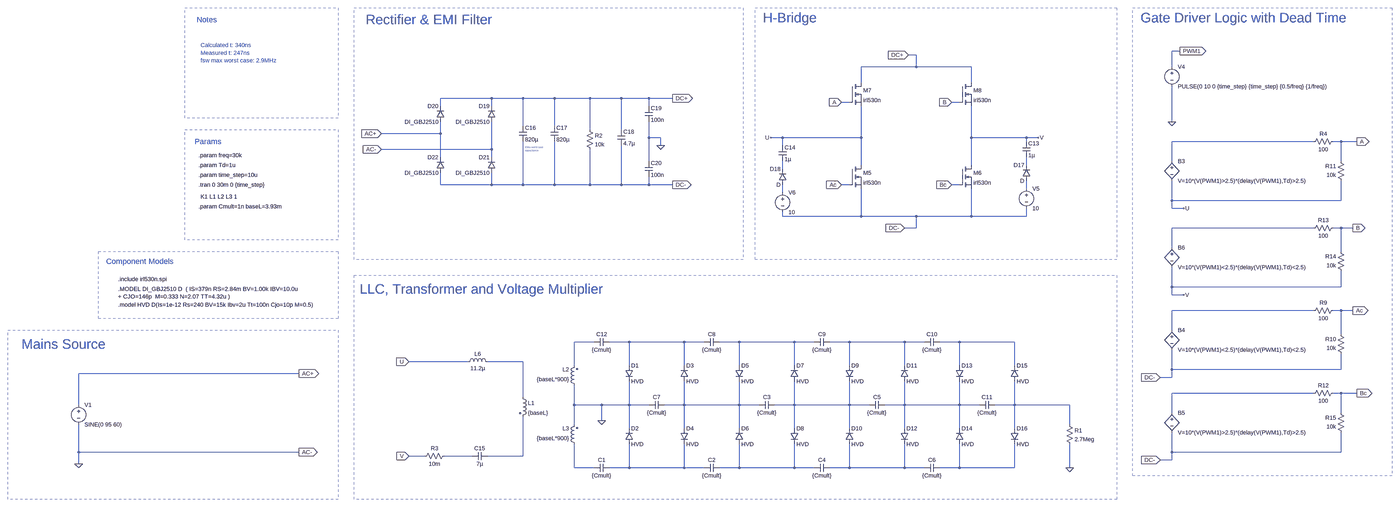
[diagram p0: schematic PowerConverter_AllStages.asc, whole sheet]
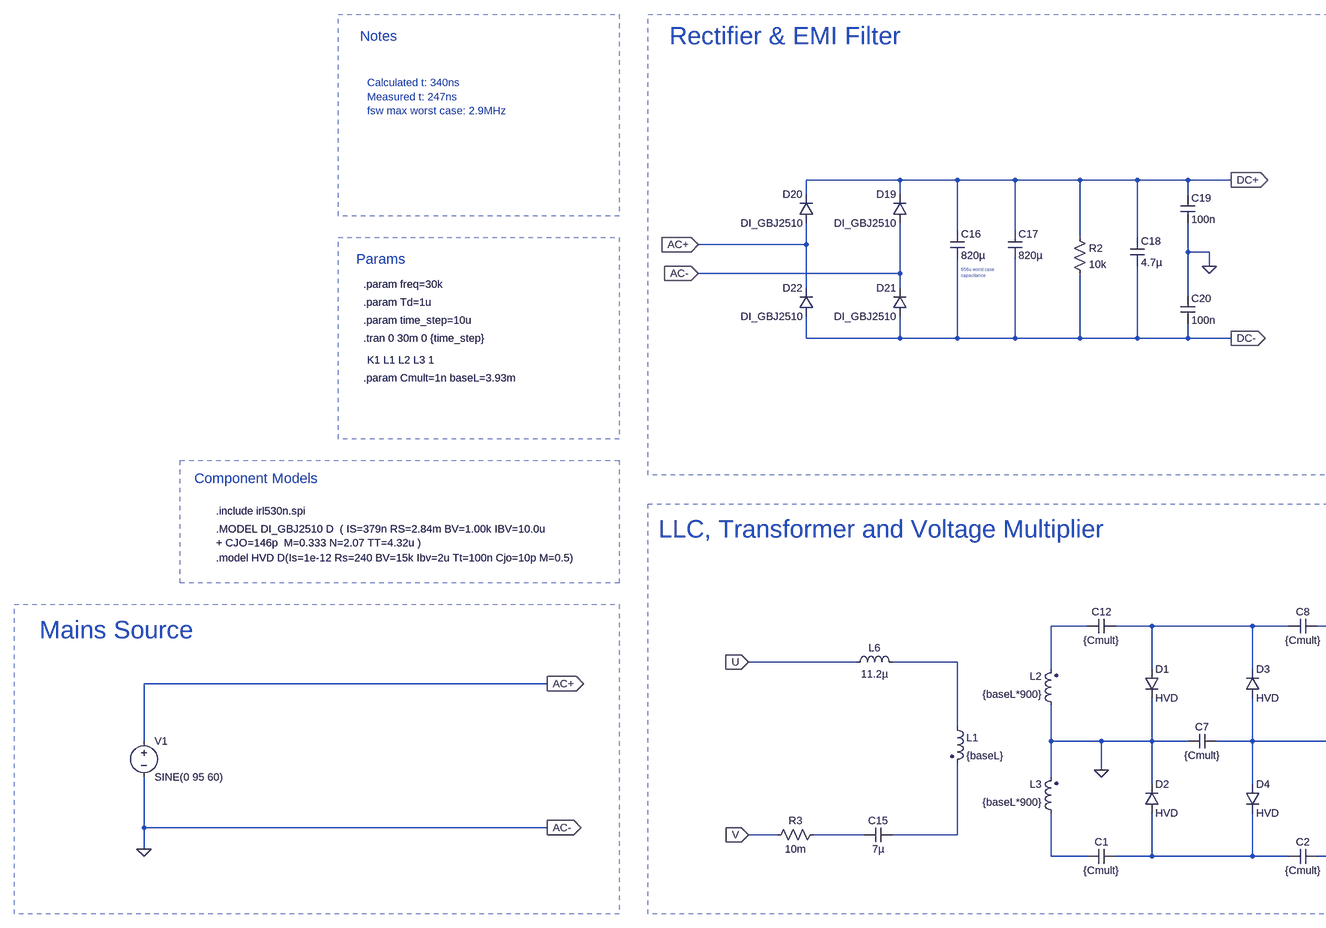
[diagram p1: schematic PowerConverter_AllStages.asc, part, row 1 of 1, column 1 of 2]
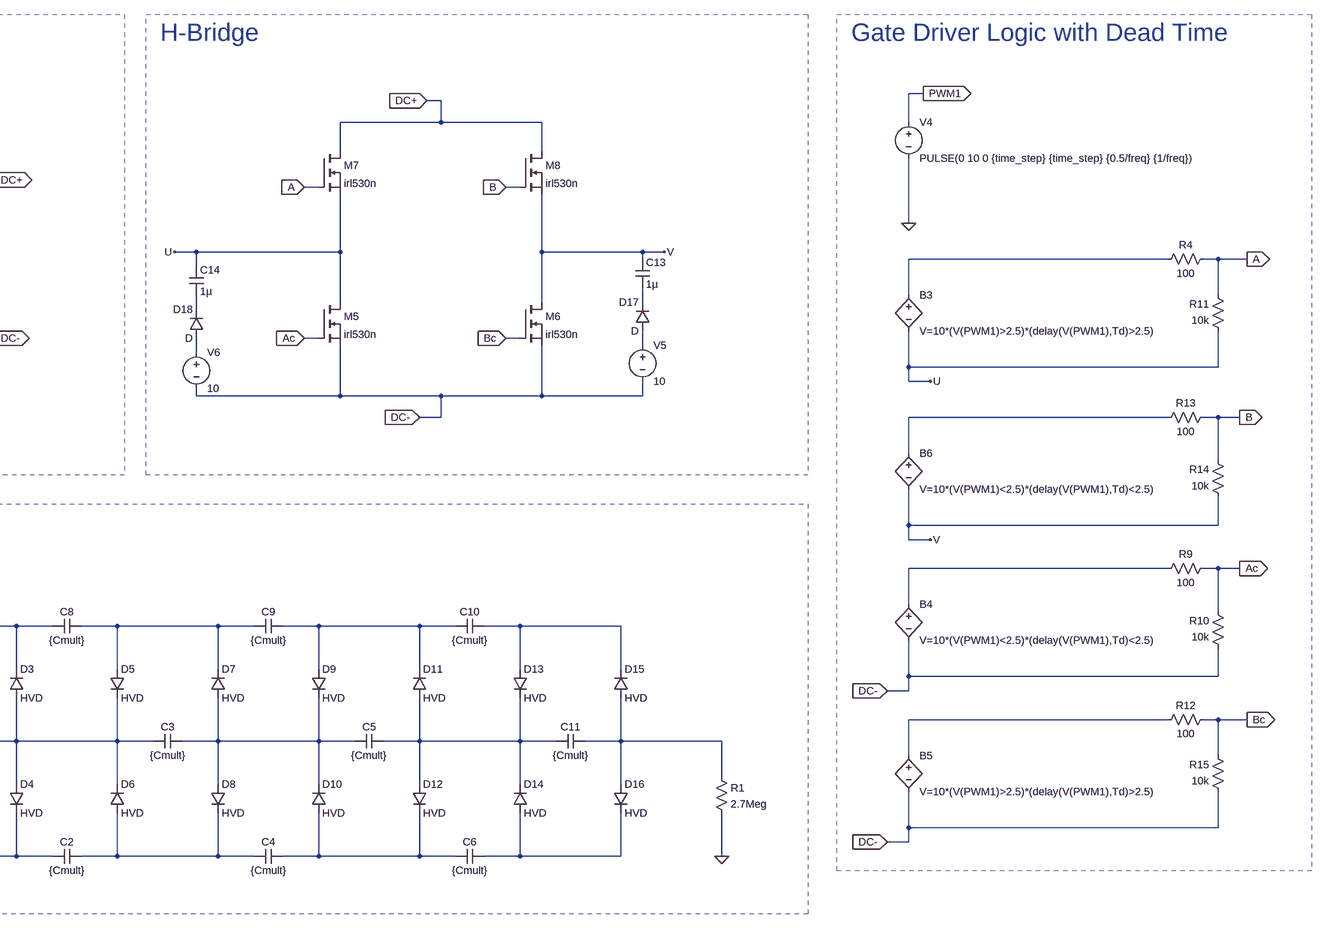
[diagram p2: schematic PowerConverter_AllStages.asc, part, row 1 of 1, column 2 of 2]
PowerConverter_AllStages.asc, the LTspice schematic file:
Version 4.1
SHEET 1 5252 740
WIRE 48 -1456 16 -1456
WIRE -1024 -1440 -1056 -1440
WIRE -1024 -1392 -1024 -1440
WIRE -1024 -1392 -1248 -1392
WIRE -800 -1392 -1024 -1392
WIRE 16 -1392 16 -1456
WIRE -1248 -1328 -1248 -1392
WIRE -800 -1328 -800 -1392
WIRE -2752 -1264 -2960 -1264
WIRE -2624 -1264 -2752 -1264
WIRE -2496 -1264 -2624 -1264
WIRE -2352 -1264 -2496 -1264
WIRE -2224 -1264 -2352 -1264
WIRE -2112 -1264 -2224 -1264
WIRE -2016 -1264 -2112 -1264
WIRE -1296 -1248 -1328 -1248
WIRE -848 -1248 -880 -1248
WIRE -2960 -1232 -2960 -1264
WIRE -2752 -1232 -2752 -1264
WIRE -2112 -1232 -2112 -1264
WIRE 16 -1168 16 -1312
WIRE -2624 -1152 -2624 -1264
WIRE -2496 -1152 -2496 -1264
WIRE -2352 -1136 -2352 -1264
WIRE -2224 -1136 -2224 -1264
WIRE -2960 -1120 -2960 -1168
WIRE -2960 -1120 -3200 -1120
WIRE -2112 -1104 -2112 -1168
WIRE -2064 -1104 -2112 -1104
WIRE -1568 -1104 -1616 -1104
WIRE -1248 -1104 -1248 -1232
WIRE -1248 -1104 -1568 -1104
WIRE -800 -1104 -800 -1232
WIRE -576 -1104 -800 -1104
WIRE -528 -1104 -576 -1104
WIRE -576 -1088 -576 -1104
WIRE 592 -1088 16 -1088
WIRE 704 -1088 672 -1088
WIRE 768 -1088 704 -1088
WIRE -2064 -1072 -2064 -1104
WIRE -1568 -1072 -1568 -1104
WIRE -2752 -1056 -2752 -1168
WIRE -2752 -1056 -3200 -1056
WIRE -2960 -1024 -2960 -1120
WIRE -2752 -1024 -2752 -1056
WIRE -2112 -1008 -2112 -1104
WIRE 16 -1008 16 -1088
WIRE 704 -1008 704 -1088
WIRE -1248 -992 -1248 -1104
WIRE -800 -992 -800 -1104
WIRE -576 -992 -576 -1024
WIRE -1568 -976 -1568 -1008
WIRE -2960 -912 -2960 -960
WIRE -2752 -912 -2752 -960
WIRE -2752 -912 -2960 -912
WIRE -2624 -912 -2624 -1088
WIRE -2624 -912 -2752 -912
WIRE -2496 -912 -2496 -1088
WIRE -2496 -912 -2624 -912
WIRE -2352 -912 -2352 -1056
WIRE -2352 -912 -2496 -912
WIRE -2224 -912 -2224 -1072
WIRE -2224 -912 -2352 -912
WIRE -2112 -912 -2112 -944
WIRE -2112 -912 -2224 -912
WIRE -2016 -912 -2112 -912
WIRE -1296 -912 -1328 -912
WIRE -848 -912 -880 -912
WIRE -576 -896 -576 -928
WIRE -1568 -880 -1568 -912
WIRE 16 -848 16 -928
WIRE 704 -848 704 -928
WIRE 704 -848 16 -848
WIRE 16 -816 16 -848
WIRE 64 -816 16 -816
WIRE -1568 -784 -1568 -800
WIRE -1248 -784 -1248 -896
WIRE -1248 -784 -1568 -784
WIRE -1024 -784 -1248 -784
WIRE -800 -784 -800 -896
WIRE -800 -784 -1024 -784
WIRE -576 -784 -576 -816
WIRE -576 -784 -800 -784
WIRE -1024 -736 -1024 -784
WIRE -1024 -736 -1072 -736
WIRE 592 -736 16 -736
WIRE 704 -736 672 -736
WIRE 752 -736 704 -736
WIRE 16 -656 16 -736
WIRE 704 -640 704 -736
WIRE 16 -496 16 -576
WIRE 704 -496 704 -560
WIRE 704 -496 16 -496
WIRE 16 -464 16 -496
WIRE 64 -464 16 -464
WIRE 592 -400 16 -400
WIRE 704 -400 672 -400
WIRE 752 -400 704 -400
WIRE 16 -320 16 -400
WIRE 704 -304 704 -400
WIRE -2336 -272 -2416 -272
WIRE -2192 -272 -2272 -272
WIRE -1968 -272 -2192 -272
WIRE -1888 -272 -1968 -272
WIRE -1744 -272 -1824 -272
WIRE -1520 -272 -1744 -272
WIRE -1440 -272 -1520 -272
WIRE -1296 -272 -1376 -272
WIRE -1072 -272 -1296 -272
WIRE -992 -272 -1072 -272
WIRE -848 -272 -928 -272
WIRE -624 -272 -848 -272
WIRE -2848 -192 -3088 -192
WIRE -2624 -192 -2768 -192
WIRE -2416 -176 -2416 -272
WIRE -2192 -176 -2192 -272
WIRE -1968 -176 -1968 -272
WIRE -1744 -176 -1744 -272
WIRE -1520 -176 -1520 -272
WIRE -1296 -176 -1296 -272
WIRE -1072 -176 -1072 -272
WIRE -848 -176 -848 -272
WIRE -624 -176 -624 -272
WIRE 16 -160 16 -240
WIRE 704 -160 704 -224
WIRE 704 -160 16 -160
WIRE -3536 -144 -4432 -144
WIRE 16 -128 16 -160
WIRE 16 -128 -32 -128
WIRE 592 -64 16 -64
WIRE 704 -64 672 -64
WIRE 768 -64 704 -64
WIRE -2624 -48 -2624 -192
WIRE -4432 -16 -4432 -144
WIRE -2416 -16 -2416 -96
WIRE -2304 -16 -2416 -16
WIRE -2192 -16 -2192 -112
WIRE -2192 -16 -2304 -16
WIRE -2112 -16 -2192 -16
WIRE -1968 -16 -1968 -112
WIRE -1968 -16 -2048 -16
WIRE -1744 -16 -1744 -112
WIRE -1744 -16 -1968 -16
WIRE -1664 -16 -1744 -16
WIRE -1520 -16 -1520 -112
WIRE -1520 -16 -1600 -16
WIRE -1296 -16 -1296 -112
WIRE -1296 -16 -1520 -16
WIRE -1216 -16 -1296 -16
WIRE -1072 -16 -1072 -112
WIRE -1072 -16 -1152 -16
WIRE -848 -16 -848 -112
WIRE -848 -16 -1072 -16
WIRE -768 -16 -848 -16
WIRE -624 -16 -624 -112
WIRE -624 -16 -704 -16
WIRE -400 -16 -624 -16
WIRE 16 16 16 -64
WIRE 704 16 704 -64
WIRE -2304 48 -2304 -16
WIRE -2416 64 -2416 -16
WIRE -400 64 -400 -16
WIRE -2192 80 -2192 -16
WIRE -1968 80 -1968 -16
WIRE -1744 80 -1744 -16
WIRE -1520 80 -1520 -16
WIRE -1296 80 -1296 -16
WIRE -1072 80 -1072 -16
WIRE -848 80 -848 -16
WIRE -624 80 -624 -16
WIRE -4432 176 -4432 64
WIRE -3536 176 -4432 176
WIRE 16 176 16 96
WIRE 704 176 704 96
WIRE 704 176 16 176
WIRE -3024 192 -3088 192
WIRE -2832 192 -2944 192
WIRE -2624 192 -2624 32
WIRE -2624 192 -2768 192
WIRE 16 208 16 176
WIRE 16 208 -32 208
WIRE -4432 224 -4432 176
WIRE -2416 240 -2416 144
WIRE -2336 240 -2416 240
WIRE -2192 240 -2192 144
WIRE -2192 240 -2272 240
WIRE -1968 240 -1968 144
WIRE -1968 240 -2192 240
WIRE -1888 240 -1968 240
WIRE -1744 240 -1744 144
WIRE -1744 240 -1824 240
WIRE -1520 240 -1520 144
WIRE -1520 240 -1744 240
WIRE -1440 240 -1520 240
WIRE -1296 240 -1296 144
WIRE -1296 240 -1376 240
WIRE -1072 240 -1072 144
WIRE -1072 240 -1296 240
WIRE -992 240 -1072 240
WIRE -848 240 -848 144
WIRE -848 240 -928 240
WIRE -624 240 -624 144
WIRE -624 240 -848 240
WIRE -400 240 -400 144
FLAG -400 240 0
FLAG -2304 48 0
FLAG -3088 -192 U
IOPIN -3088 -192 In
FLAG -3088 192 V
IOPIN -3088 192 In
FLAG -1328 -1248 A
IOPIN -1328 -1248 In
FLAG -1328 -912 Ac
IOPIN -1328 -912 In
FLAG -880 -1248 B
IOPIN -880 -1248 In
FLAG -880 -912 Bc
IOPIN -880 -912 In
FLAG 16 -1168 0
FLAG 48 -1456 PWM1
IOPIN 48 -1456 Out
FLAG 768 -1088 A
IOPIN 768 -1088 Out
FLAG 752 -400 Ac
IOPIN 752 -400 Out
FLAG 768 -64 Bc
IOPIN 768 -64 Out
FLAG 752 -736 B
IOPIN 752 -736 Out
FLAG -1616 -1104 U
FLAG -528 -1104 V
FLAG 64 -816 U
FLAG 64 -464 V
FLAG -3200 -1120 AC+
IOPIN -3200 -1120 In
FLAG -3200 -1056 AC-
IOPIN -3200 -1056 In
FLAG -3536 -144 AC+
IOPIN -3536 -144 Out
FLAG -3536 176 AC-
IOPIN -3536 176 Out
FLAG -4432 224 0
FLAG -2064 -1072 0
FLAG -2016 -1264 DC+
IOPIN -2016 -1264 Out
FLAG -2016 -912 DC-
IOPIN -2016 -912 Out
FLAG -1056 -1440 DC+
IOPIN -1056 -1440 In
FLAG -1072 -736 DC-
IOPIN -1072 -736 In
FLAG -32 -128 DC-
IOPIN -32 -128 In
FLAG -32 208 DC-
IOPIN -32 208 In
SYMBOL cap -1824 224 R90
WINDOW 0 0 32 VBottom 2
WINDOW 3 32 32 VTop 2
SYMATTR InstName C2
SYMATTR Value {Cmult}
SYMBOL cap -1600 0 M270
WINDOW 0 32 32 VTop 2
WINDOW 3 0 32 VBottom 2
SYMATTR InstName C3
SYMATTR Value {Cmult}
SYMBOL cap -1376 224 R90
WINDOW 0 0 32 VBottom 2
WINDOW 3 32 32 VTop 2
SYMATTR InstName C4
SYMATTR Value {Cmult}
SYMBOL res -416 48 R0
SYMATTR InstName R1
SYMATTR Value 2.7Meg
SYMBOL cap -1152 0 M270
WINDOW 0 32 32 VTop 2
WINDOW 3 0 32 VBottom 2
SYMATTR InstName C5
SYMATTR Value {Cmult}
SYMBOL cap -928 224 R90
WINDOW 0 0 32 VBottom 2
WINDOW 3 32 32 VTop 2
SYMATTR InstName C6
SYMATTR Value {Cmult}
SYMBOL cap -2336 -256 R270
WINDOW 0 32 32 VTop 2
WINDOW 3 0 32 VBottom 2
SYMATTR InstName C12
SYMATTR Value {Cmult}
SYMBOL cap -2048 -32 R90
WINDOW 0 0 32 VBottom 2
WINDOW 3 32 32 VTop 2
SYMATTR InstName C7
SYMATTR Value {Cmult}
SYMBOL cap -1824 -288 R90
WINDOW 0 0 32 VBottom 2
WINDOW 3 32 32 VTop 2
SYMATTR InstName C8
SYMATTR Value {Cmult}
SYMBOL cap -1376 -288 R90
WINDOW 0 0 32 VBottom 2
WINDOW 3 32 32 VTop 2
SYMATTR InstName C9
SYMATTR Value {Cmult}
SYMBOL cap -928 -288 R90
WINDOW 0 0 32 VBottom 2
WINDOW 3 32 32 VTop 2
SYMATTR InstName C10
SYMATTR Value {Cmult}
SYMBOL cap -2336 256 R270
WINDOW 0 32 32 VTop 2
WINDOW 3 0 32 VBottom 2
SYMATTR InstName C1
SYMATTR Value {Cmult}
SYMBOL cap -704 0 M270
WINDOW 0 32 32 VTop 2
WINDOW 3 0 32 VBottom 2
SYMATTR InstName C11
SYMATTR Value {Cmult}
SYMBOL ind2 -2400 -80 R180
WINDOW 0 36 80 Left 2
WINDOW 3 36 40 Left 2
SYMATTR InstName L2
SYMATTR Value {baseL*900}
SYMATTR Type ind
SYMBOL ind2 -2400 160 R180
WINDOW 0 36 80 Left 2
WINDOW 3 36 40 Left 2
SYMATTR InstName L3
SYMATTR Value {baseL*900}
SYMATTR Type ind
SYMBOL ind2 -2640 -64 R0
SYMATTR InstName L1
SYMATTR Value {baseL}
SYMATTR Type ind
SYMATTR SpiceLine Rser=1
SYMBOL diode -2208 -176 R0
SYMATTR InstName D1
SYMATTR Value HVD
SYMBOL diode -2208 144 M180
WINDOW 0 24 64 Left 2
WINDOW 3 24 0 Left 2
SYMATTR InstName D2
SYMATTR Value HVD
SYMBOL diode -1984 -112 M180
WINDOW 0 24 64 Left 2
WINDOW 3 24 0 Left 2
SYMATTR InstName D3
SYMATTR Value HVD
SYMBOL diode -1984 80 R0
SYMATTR InstName D4
SYMATTR Value HVD
SYMBOL diode -1760 -176 R0
SYMATTR InstName D5
SYMATTR Value HVD
SYMBOL diode -1760 144 M180
WINDOW 0 24 64 Left 2
WINDOW 3 24 0 Left 2
SYMATTR InstName D6
SYMATTR Value HVD
SYMBOL diode -1536 -112 M180
WINDOW 0 24 64 Left 2
WINDOW 3 24 0 Left 2
SYMATTR InstName D7
SYMATTR Value HVD
SYMBOL diode -1536 80 R0
SYMATTR InstName D8
SYMATTR Value HVD
SYMBOL diode -1312 -176 R0
SYMATTR InstName D9
SYMATTR Value HVD
SYMBOL diode -1312 144 M180
WINDOW 0 24 64 Left 2
WINDOW 3 24 0 Left 2
SYMATTR InstName D10
SYMATTR Value HVD
SYMBOL diode -1088 -112 M180
WINDOW 0 24 64 Left 2
WINDOW 3 24 0 Left 2
SYMATTR InstName D11
SYMATTR Value HVD
SYMBOL diode -1088 80 R0
SYMATTR InstName D12
SYMATTR Value HVD
SYMBOL diode -864 -176 R0
SYMATTR InstName D13
SYMATTR Value HVD
SYMBOL diode -864 144 M180
WINDOW 0 24 64 Left 2
WINDOW 3 24 0 Left 2
SYMATTR InstName D14
SYMATTR Value HVD
SYMBOL diode -640 -112 M180
WINDOW 0 24 64 Left 2
WINDOW 3 24 0 Left 2
SYMATTR InstName D15
SYMATTR Value HVD
SYMBOL diode -640 80 R0
SYMATTR InstName D16
SYMATTR Value HVD
SYMBOL ind -2864 -176 R270
WINDOW 0 32 56 VTop 2
WINDOW 3 5 56 VBottom 2
SYMATTR InstName L6
SYMATTR Value 11.2µ
SYMBOL cap -2768 176 R90
WINDOW 0 0 32 VBottom 2
WINDOW 3 32 32 VTop 2
SYMATTR InstName C15
SYMATTR Value 7µ
SYMBOL res -2928 176 R90
WINDOW 0 0 56 VBottom 2
WINDOW 3 32 56 VTop 2
SYMATTR InstName R3
SYMATTR Value 10m
SYMBOL nmos -1296 -992 R0
SYMATTR InstName M5
SYMATTR Value irl530n
SYMATTR Prefix X
SYMBOL nmos -848 -992 R0
SYMATTR InstName M6
SYMATTR Value irl530n
SYMATTR Prefix X
SYMBOL nmos -1296 -1328 R0
SYMATTR InstName M7
SYMATTR Value irl530n
SYMATTR Prefix X
SYMBOL nmos -848 -1328 R0
SYMATTR InstName M8
SYMATTR Value irl530n
SYMATTR Prefix X
SYMBOL voltage 16 -1408 R0
WINDOW 123 0 0 Left 0
WINDOW 39 0 0 Left 0
SYMATTR InstName V4
SYMATTR Value PULSE(0 10 0 {time_step} {time_step} {0.5/freq} {1/freq})
SYMBOL bv 16 -1024 R0
SYMATTR InstName B3
SYMATTR Value V=10*(V(PWM1)>2.5)*(delay(V(PWM1),Td)>2.5)
SYMBOL bv 16 -336 R0
SYMATTR InstName B4
SYMATTR Value V=10*(V(PWM1)<2.5)*(delay(V(PWM1),Td)<2.5)
SYMBOL res 688 -1104 R90
WINDOW 0 0 56 VBottom 2
WINDOW 3 32 56 VTop 2
SYMATTR InstName R4
SYMATTR Value 100
SYMBOL res 688 -416 R90
WINDOW 0 0 56 VBottom 2
WINDOW 3 32 56 VTop 2
SYMATTR InstName R9
SYMATTR Value 100
SYMBOL res 720 -208 R180
WINDOW 0 36 76 Left 2
WINDOW 3 36 40 Left 2
SYMATTR InstName R10
SYMATTR Value 10k
SYMBOL res 720 -912 R180
WINDOW 0 36 76 Left 2
WINDOW 3 36 40 Left 2
SYMATTR InstName R11
SYMATTR Value 10k
SYMBOL cap -592 -1088 R0
SYMATTR InstName C13
SYMATTR Value 1µ
SYMBOL voltage -576 -912 R0
WINDOW 123 0 0 Left 0
WINDOW 39 0 0 Left 0
SYMATTR InstName V5
SYMATTR Value 10
SYMBOL diode -560 -928 R180
WINDOW 0 24 64 Left 2
WINDOW 3 24 0 Left 2
SYMATTR InstName D17
SYMBOL cap -1584 -1072 R0
SYMATTR InstName C14
SYMATTR Value 1µ
SYMBOL voltage -1568 -896 R0
WINDOW 123 0 0 Left 0
WINDOW 39 0 0 Left 0
SYMATTR InstName V6
SYMATTR Value 10
SYMBOL diode -1552 -912 R180
WINDOW 0 24 64 Left 2
WINDOW 3 24 0 Left 2
SYMATTR InstName D18
SYMBOL bv 16 0 R0
SYMATTR InstName B5
SYMATTR Value V=10*(V(PWM1)>2.5)*(delay(V(PWM1),Td)>2.5)
SYMBOL bv 16 -672 R0
SYMATTR InstName B6
SYMATTR Value V=10*(V(PWM1)<2.5)*(delay(V(PWM1),Td)<2.5)
SYMBOL res 688 -80 R90
WINDOW 0 0 56 VBottom 2
WINDOW 3 32 56 VTop 2
SYMATTR InstName R12
SYMATTR Value 100
SYMBOL res 688 -752 R90
WINDOW 0 0 56 VBottom 2
WINDOW 3 32 56 VTop 2
SYMATTR InstName R13
SYMATTR Value 100
SYMBOL res 720 -544 R180
WINDOW 0 36 76 Left 2
WINDOW 3 36 40 Left 2
SYMATTR InstName R14
SYMATTR Value 10k
SYMBOL res 720 112 R180
WINDOW 0 36 76 Left 2
WINDOW 3 36 40 Left 2
SYMATTR InstName R15
SYMATTR Value 10k
SYMBOL cap -2640 -1152 R0
SYMATTR InstName C16
SYMATTR Value 820µ
SYMBOL cap -2512 -1152 R0
SYMATTR InstName C17
SYMATTR Value 820µ
SYMBOL voltage -4432 -32 R0
WINDOW 123 0 0 Left 0
WINDOW 39 0 0 Left 0
SYMATTR InstName V1
SYMATTR Value SINE(0 95 60)
SYMBOL diode -2736 -1168 R180
WINDOW 0 24 64 Left 2
WINDOW 3 24 0 Left 2
SYMATTR InstName D19
SYMATTR Value DI_GBJ2510
SYMBOL diode -2944 -1168 R180
WINDOW 0 24 64 Left 2
WINDOW 3 24 0 Left 2
SYMATTR InstName D20
SYMATTR Value DI_GBJ2510
SYMBOL diode -2736 -960 R180
WINDOW 0 24 64 Left 2
WINDOW 3 24 0 Left 2
SYMATTR InstName D21
SYMATTR Value DI_GBJ2510
SYMBOL diode -2944 -960 R180
WINDOW 0 24 64 Left 2
WINDOW 3 24 0 Left 2
SYMATTR InstName D22
SYMATTR Value DI_GBJ2510
SYMBOL cap -2240 -1136 R0
SYMATTR InstName C18
SYMATTR Value 4.7µ
SYMBOL cap -2128 -1232 R0
SYMATTR InstName C19
SYMATTR Value 100n
SYMBOL cap -2128 -1008 R0
SYMATTR InstName C20
SYMATTR Value 100n
SYMBOL res -2368 -1152 R0
SYMATTR InstName R2
SYMATTR Value 10k
TEXT -3936 -864 Left 2 !K1 L1 L2 L3 1
TEXT -3944 -824 Left 2 !.param Cmult=1n baseL=3.93m
TEXT -4272 -424 Left 2 !.model HVD D(Is=1e-12 Rs=240 BV=15k Ibv=2u Tt=100n Cjo=10p M=0.5)
TEXT -4272 -528 Left 2 !.include irl530n.spi
TEXT -3944 -912 Left 2 !.tran 0 30m 0 {time_step}
TEXT -3944 -1032 Left 2 !.param freq=30k
TEXT -3944 -992 Left 2 !.param Td=1u
TEXT -3944 -952 Left 2 !.param time_step=10u
TEXT -3960 -1088 Left 3 ;Params
TEXT -3952 -1584 Left 3 ;Notes
TEXT -3936 -1480 Left 2 ;Calculated t: 340ns\nMeasured t: 247ns\nfsw max worst case: 2.9MHz
TEXT -4320 -600 Left 3 ;Component Models
TEXT -3288 -488 Left 5 ;LLC, Transformer and Voltage Multiplier
TEXT -112 -1592 Left 5 ;Gate Driver Logic with Dead Time
TEXT -1648 -1592 Left 5 ;H-Bridge
TEXT -3264 -1584 Left 5 ;Rectifier & EMI Filter
TEXT -4664 -264 Left 5 ;Mains Source
TEXT -4272 -488 Left 2 !.MODEL DI_GBJ2510 D  ( IS=379n RS=2.84m BV=1.00k IBV=10.0u\n+ CJO=146p  M=0.333 N=2.07 TT=4.32u )
TEXT -2616 -1064 Left 0 ;656u worst case \ncapacitance
RECTANGLE Normal -3376 -1184 -4000 -1632 1
RECTANGLE Normal -3376 -688 -4000 -1136 1
RECTANGLE Normal -3376 -368 -4352 -640 1
RECTANGLE Normal -208 368 -3312 -544 1
RECTANGLE Normal 912 272 -144 -1632 1
RECTANGLE Normal -208 -608 -1680 -1632 1
RECTANGLE Normal -3312 -1632 -1728 -608 1
RECTANGLE Normal -3376 368 -4720 -320 1

The netlist it stands for:
* PowerConverter_AllStages.asc
C2 N023 N022 {Cmult}
C3 N016 N015 {Cmult}
C4 N024 N023 {Cmult}
R1 N018 0 2.7Meg
C5 N017 N016 {Cmult}
C6 N025 N024 {Cmult}
C12 N008 N009 {Cmult}
C7 N015 0 {Cmult}
C8 N010 N009 {Cmult}
C9 N011 N010 {Cmult}
C10 N012 N011 {Cmult}
C1 N021 N022 {Cmult}
C11 N018 N017 {Cmult}
L2 0 N008 {baseL*900}
L3 N021 0 {baseL*900}
L1 N013 N020 {baseL} Rser=1
D1 N009 0 HVD
D2 N022 0 HVD
D3 N015 N009 HVD
D4 N015 N022 HVD
D5 N010 N015 HVD
D6 N023 N015 HVD
D7 N016 N010 HVD
D8 N016 N023 HVD
D9 N011 N016 HVD
D10 N024 N016 HVD
D11 N017 N011 HVD
D12 N017 N024 HVD
D13 N012 N017 HVD
D14 N025 N017 HVD
D15 N018 N012 HVD
D16 N018 N025 HVD
L6 U N013 11.2µ
C15 N020 N019 7µ
R3 N019 V 10m
X§M5 U Ac DC- irl530n  ; pins D G S
X§M6 V Bc DC- irl530n  ; pins D G S
X§M7 DC+ A U irl530n  ; pins D G S
X§M8 DC+ B V irl530n  ; pins D G S
V4 PWM1 0 PULSE(0 10 0 {time_step} {time_step} {0.5/freq} {1/freq})
B3 N001 U V=10*(V(PWM1)>2.5)*(delay(V(PWM1),Td)>2.5)
B4 N007 DC- V=10*(V(PWM1)<2.5)*(delay(V(PWM1),Td)<2.5)
R4 A N001 100
R9 Ac N007 100
R10 DC- Ac 10k
R11 U A 10k
C13 V N002 1µ
V5 N004 DC- 10
D17 N004 N002 D
C14 U N003 1µ
V6 N005 DC- 10
D18 N005 N003 D
B5 N014 DC- V=10*(V(PWM1)>2.5)*(delay(V(PWM1),Td)>2.5)
B6 N006 V V=10*(V(PWM1)<2.5)*(delay(V(PWM1),Td)<2.5)
R12 Bc N014 100
R13 B N006 100
R14 V B 10k
R15 DC- Bc 10k
C16 DC+ DC- 820µ
C17 DC+ DC- 820µ
V1 AC+ 0 SINE(0 95 60)
D19 0 DC+ DI_GBJ2510
D20 AC+ DC+ DI_GBJ2510
D21 DC- 0 DI_GBJ2510
D22 DC- AC+ DI_GBJ2510
C18 DC+ DC- 4.7µ
C19 DC+ 0 100n
C20 0 DC- 100n
R2 DC+ DC- 10k
.model D D
.lib standard.dio
K1 L1 L2 L3 1
.param Cmult=1n baseL=3.93m
.model HVD D(Is=1e-12 Rs=240 BV=15k Ibv=2u Tt=100n Cjo=10p M=0.5)
.include irl530n.spi
.tran 0 30m 0 {time_step}
.param freq=30k
.param Td=1u
.param time_step=10u
* Params
* Notes
* Calculated t: 340ns
* Measured t: 247ns
* fsw max worst case: 2.9MHz
* Component Models
* LLC, Transformer and Voltage Multiplier
* Gate Driver Logic with Dead Time
* H-Bridge
* Rectifier & EMI Filter
* Mains Source
.MODEL DI_GBJ2510 D  ( IS=379n RS=2.84m BV=1.00k IBV=10.0u
+ CJO=146p  M=0.333 N=2.07 TT=4.32u )
* 656u worst case
* capacitance
.backanno
.end